# Altium project NB992F.PrjPcb
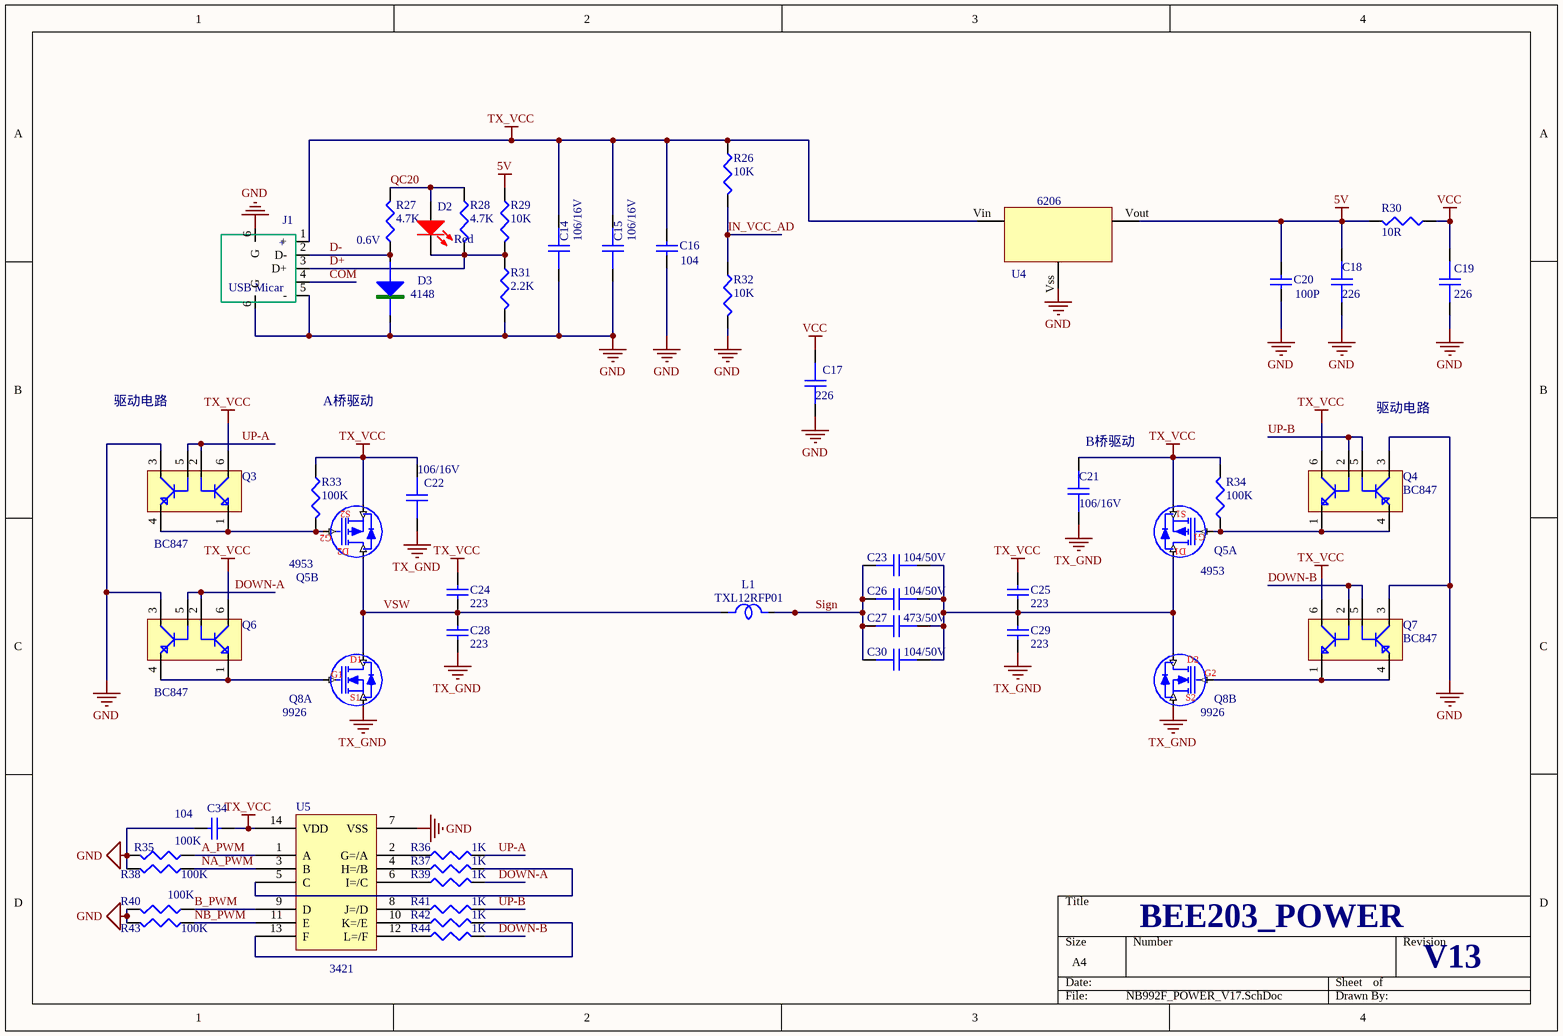
[diagram p0: NB992F_POWER_V17.SchDoc]
2 sheets, 90 parts. Net scope: global (net labels, ports and power ports of the same name join across sheets).
Board file: XL992FXT10W.PcbDoc
Sheets:
  NB992F_POWER_V17.SchDoc
  NB992F_XL_N76E003_MAIN.SchDoc

## Sheet NB992F_POWER_V17.SchDoc
size A4

### Parts
C14  106/16V  [C0805]
C15  106/16V  [C0805]
C16  104  [C0402]
C17  226  [C0603]
C18  226  [C0805]
C19  226  [C0805]
C20  100P  [C0402]
C21  106/16V  [C0805]
C22  106/16V  [C0805]
C23  104/50V  [C1206]
C24  223  [C0603]
C25  223  [C0603]
C26  104/50V  [C1206]
C27  473/50V  [C1206]
C28  223  [C0603]
C29  223  [C0603]
C30  104/50V  [C1206]
C34  104  [C0402]
D2  Red  [LED0603]
D3  4148  [SOD323]
J1  USB Micar  [USB MRO]
L1  TXL12RFP01  [SPIN2_5mm]
Q3  BC847  [SOT-363]
Q4  BC847  [SOT-363]
Q5  4953  [SOP8D]  (parts A,B of 2)
Q6  BC847  [SOT-363]
Q7  BC847  [SOT-363]
Q8  9926  [SOP8D]  (parts A,B of 2)
R26  10K  [R0402]
R27  4.7K  [R0402]
R28  4.7K  [R0402]
R29  10K  [R0402]
R30  10R  [R0402]
R31  2.2K  [R0402]
R32  10K  [R0402]
R33  100K  [R0402]
R34  100K  [R0402]
R35  100K  [R0402]
R36  1K  [R0402]
R37  1K  [R0402]
R38  100K  [R0402]
R39  1K  [R0402]
R40  100K  [R0402]
R41  1K  [R0402]
R42  1K  [R0402]
R43  100K  [R0402]
R44  1K  [R0402]
U4  6206  [SOT-89-5V]
U5  3421  [SOP14]

### Nets
5V: C18.1 C20.1 R29.2 R30.2 U4.Vout
GND: C14.2 C15.2 C16.2 C17.1 C18.2 C19.1 C20.2 C34.1 D3.2 J1.5(-) J1.6(G) Q3.3 Q4.3 Q6.3 Q7.3 R31.1 R32.1 R35.2 R38.2 R40.2 R43.2 U4.Vss U5.7(VSS)
TX_GND: C21.2 C22.2 C28.1 C29.1 Q8.E1(S1) Q8.E2(S2)
TX_VCC: C14.1 C15.1 C16.1 C21.1 C22.1 C24.2 C25.2 C34.2 J1.1(+) Q3.6 Q4.6 Q5.E1(S1) Q5.E2(S2) Q6.6 Q7.6 R26.2 R33.1 R34.2 U4.Vin U5.14(VDD)
VCC: C17.2 C19.2 R30.1
A_PWM: R35.1 U5.1(A)
B_PWM: R40.1 U5.9(D)
COM: J1.4
D+: D2.2(K) J1.3(D+) R28.1 R29.1 R31.2
D-: D3.1 J1.2(D-) R27.2
DOWN-A: Q6.2 Q6.5 R39.2
DOWN-B: Q7.2 Q7.5 R44.2
IN_VCC_AD: R26.1 R32.2
NA_PWM: R38.1 U5.3(B)
NB_PWM: R43.1 U5.11(E)
QC20: D2.1(A) R27.1 R28.2
Sign: C23.1 C26.1 C27.1 C30.1 L1.2
UP-A: Q3.2 Q3.5 R36.2
UP-B: Q4.2 Q4.5 R41.2
VSW: C24.1 C28.2 L1.1 Q5.C2(D2) Q8.C1(D1)
NetC23_2: C23.2 C25.1 C26.2 C27.2 C29.2 C30.2 Q5.C1(D1) Q8.C2(D2)
NetQ3_1: Q3.1 Q3.4 Q5.B2(G2) R33.2
NetQ4_1: Q4.1 Q4.4 Q5.B1(G1) R34.1
NetQ6_1: Q6.1 Q6.4 Q8.B1(G1)
NetQ7_1: Q7.1 Q7.4 Q8.B2(G2)
NetR36_1: R36.1 U5.2(G=/A)
NetR37_1: R37.1 U5.4(H=/B)
NetR37_2: R37.2 U5.5(C)
NetR39_1: R39.1 U5.6(I=/C)
NetR41_1: R41.1 U5.8(J=/D)
NetR42_1: R42.1 U5.10(K=/E)
NetR42_2: R42.2 U5.13(F)
NetR44_1: R44.1 U5.12(L=/F)

### Notes on the sheet
- 0.6V
- 驱动电路
- A桥驱动
- (near C21) B桥驱动
- BEE203_POWER
- V13

### Library data of the parts
C14 C15 C17-C19 C21-C23 C26 C27 C30 = CH
C16 C34 = Cap: Capacitor; Published: 8-Jun-2000; LatestRevisionDate: 17-Jul-2002; LatestRevisionNote: Re-released for DXP Platform.; Publisher: Altium Limited; Value: 104
C20 C24 C25 C28 C29 = Cap: Capacitor; Value: 104; Published: 8-Jun-2000; LatestRevisionDate: 17-Jul-2002; LatestRevisionNote: Re-released for DXP Platform.; Publisher: Altium Limited
D2 = LED02
D3 = D0: 1N4001
J1 = USB
L1 = L: 1uH
Q3 Q4 Q6 Q7 = D_PNP
Q5 = MOSFETP2
Q8 = MOSFETN2
R26-R35 R38 R40 R43 = R: 1K
R36 R37 R39 R41 R42 R44 = R
U4 = VOLTREG
U5 = CD4069

## Sheet NB992F_XL_N76E003_MAIN.SchDoc
size A4
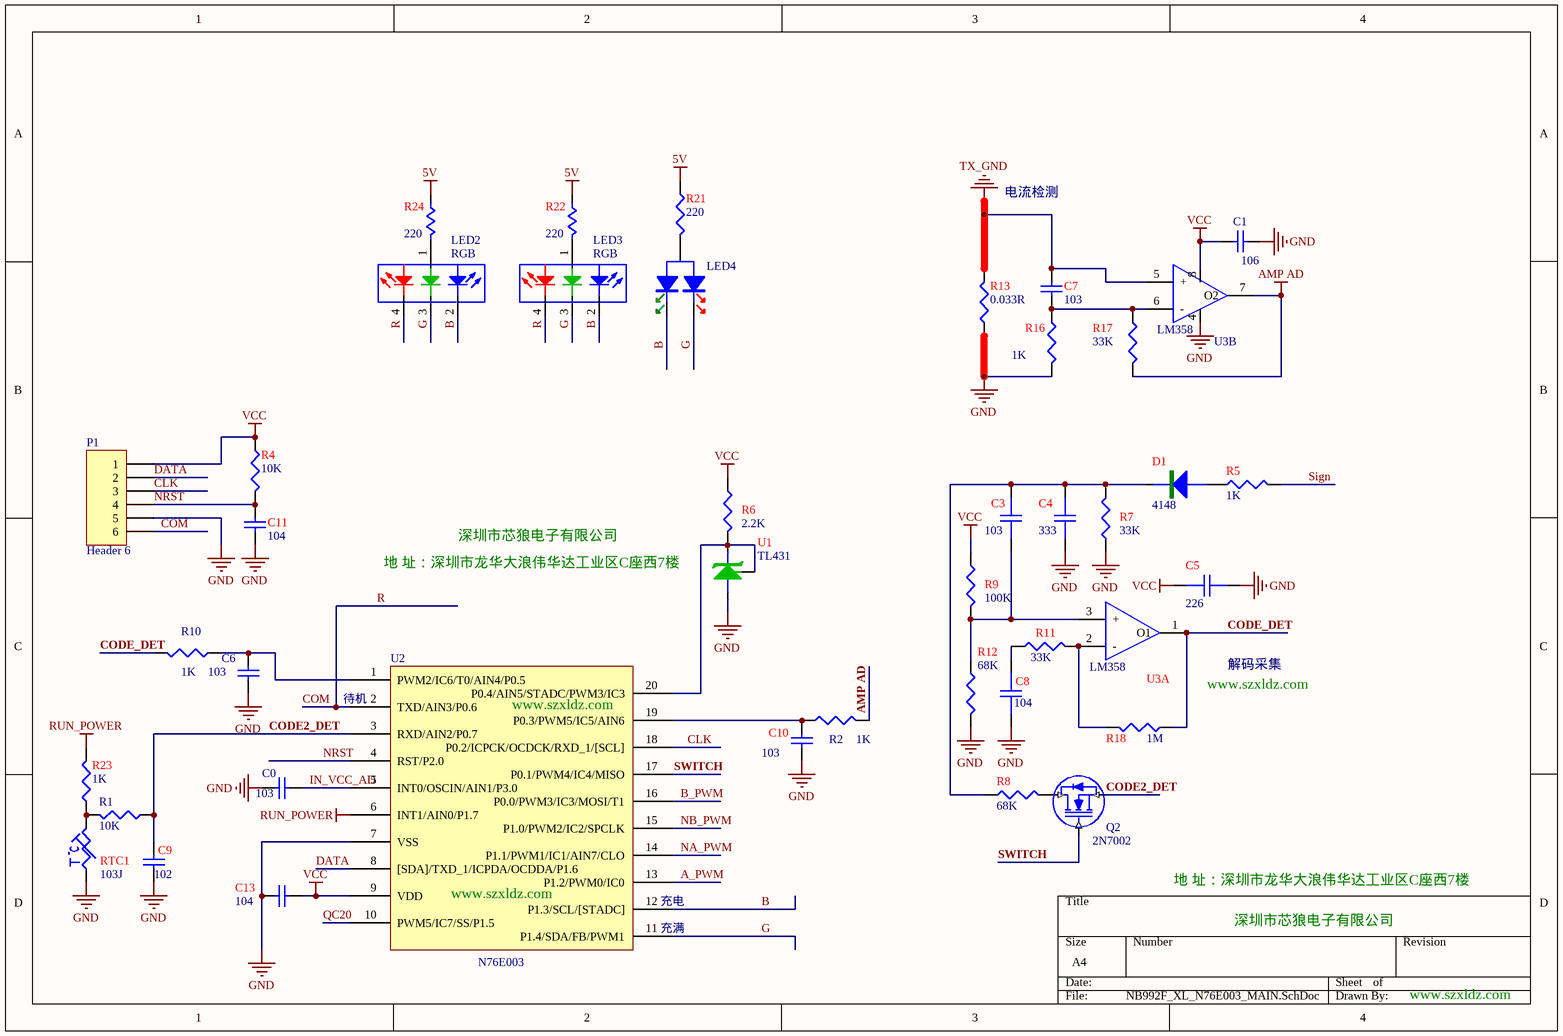
[diagram p1: NB992F_XL_N76E003_MAIN.SchDoc]

### Parts
C0  103  [C0402]
C1  106  [C0603]
C3  103  [C0402]
C4  333  [C0402]
C5  226  [C0805]
C6  103  [C0402]
C7  103  [C0402]
C8  104  [C0402]
C9  102  [C0402]
C10  103  [C0402]
C11  104  [C0402]
C13  104  [C0402]
D1  4148  [sod323]
LED2  RGB  [LED-RGB02]
LED3  RGB  [LED-RGB02]
LED4  (no value)  [LED2]
P1  Header 6  [SPIN6]
Q2  2N7002  [SOT-23B]
R1  10K  [R0402]
R2  1K  [R0402]
R4  10K  [R0402]
R5  1K  [R0402]
R6  2.2K  [R0402]
R7  33K  [R0402]
R8  68K  [R0402]
R9  100K  [R0402]
R10  1K  [R0402]
R11  33K  [R0402]
R12  68K  [R0402]
R13  0.033R  [R0805]
R16  1K  [R0402]
R17  33K  [R0402]
R18  1M  [R0402]
R21  220  [R0402]
R22  220  [R0402]
R23  1K  [R0402]
R24  220  [R0402]
RTC1  103J  [R0402]
U1  TL431  [SOT-23A]
U2  N76E003  [TSSOP20]
U3  LM358  [SOP8]  (parts A,B of 2)

### Nets
5V: R21.1 R22.1 R24.1
AMP AD: R2.2 R17.2 U3.7(O2)
GND: C0.1 C1.1 C4.1 C5.1 C6.1 C8.1 C9.1 C10.2 C11.2 C13.1 P1.5 R7.1 R12.2 R13.1 R16.2 RTC1.1 U1.1 U2.7(VSS) U3.4
RUN_POWER: R23.2 U2.6(INT1/AIN0/P1.7)
TX_GND: C7.1 R13.2 U3.5(+)
VCC: C1.2 C5.2 C13.2 P1.1 R4.1 R6.1 R9.1 U2.9(VDD) U3.8
A_PWM: U2.13(P1.2/PWM0/IC0)
B: LED2.2(A) LED3.2(A) LED4.3 U2.12(P1.3/SCL/[STADC])
B_PWM: U2.16(P0.0/PWM3/IC3/MOSI/T1)
CLK: P1.3 U2.18(P0.2/ICPCK/OCDCK/RXD_1/[SCL])
CODE2_DET: C9.2 Q2.E(S) R1.1 U2.3(RXD/AIN2/P0.7)
CODE_DET: R10.2 R18.1 U3.1(O1)
COM: LED2.4 LED3.4 P1.6 U2.2(TXD/AIN3/P0.6)  [also labelled R]
DATA: P1.2 U2.8([SDA]/TXD_1/ICPDA/OCDDA/P1.6)
G: LED2.3 LED3.3 LED4.1 U2.11(P1.4/SDA/FB/PWM1)
IN_VCC_AD: C0.2 U2.5(INT0/OSCIN/AIN1/P3.0)
NA_PWM: U2.14(P1.1/PWM1/IC1/AIN7/CLO)
NB_PWM: U2.15(P1.0/PWM2/IC2/SPCLK)
NRST: C11.1 P1.4 R4.2 U2.4(RST/P2.0)
QC20: U2.10(PWM5/IC7/SS/P1.5)
Sign: R5.2
SWITCH: Q2.B(G) U2.17(P0.1/PWM4/IC4/MISO)
NetC3_1: C3.1 C4.2 D1.2 R7.2 R8.1
NetC3_2: C3.2 R9.2 R12.1 U3.3(+)
NetC6_2: C6.2 R10.1 U2.1(PWM2/IC6/T0/AIN4/P0.5)
NetC7_2: C7.2 R16.1 R17.1 U3.6(-)
NetC8_2: C8.2 R11.1
NetC10_1: C10.1 R2.1 U2.19(P0.3/PWM5/IC5/AIN6)
NetD1_1: D1.1 R5.1
NetLED2_1: LED2.1(A) R24.2
NetLED3_1: LED3.1(A) R22.2
NetLED4_2: LED4.2 R21.2
NetQ2_C: Q2.C(D) R8.2
NetR1_2: R1.2 R23.1 RTC1.2
NetR6_2: R6.2 U1.2 U1.3 U2.20(P0.4/AIN5/STADC/PWM3/IC3)
NetR11_2: R11.2 R18.2 U3.2(-)

### Notes on the sheet
- 电流检测
- 地 址：深圳市龙华大浪伟华达工业区C座西7楼
- 深圳市芯狼电子有限公司
- (near U2) 待机
- (near U2) www.szxldz.com
- www.szxldz.com
- 解码采集
- (near U2) 充电
- (near U2) 充满

### Library data of the parts
C0 C6 C9-C11 C13 = Cap: Capacitor; Published: 8-Jun-2000; LatestRevisionDate: 17-Jul-2002; LatestRevisionNote: Re-released for DXP Platform.; Publisher: Altium Limited
  C6 C10: Value: 103
  C9: Value: 102
  C11: Value: 104
C1 C7 = Cap: Capacitor; Value: 104; Published: 8-Jun-2000; LatestRevisionDate: 17-Jul-2002; LatestRevisionNote: Re-released for DXP Platform.; Publisher: Altium Limited
C3-C5 C8 = CH
D1 = D0: 1N4001
LED2 LED3 = LED05
LED4 = LED2A
P1 = Header 6: Header, 6-Pin; LatestRevisionDate: 17-Jul-2002; LatestRevisionNote: Re-released for DXP Platform.; Publisher: Altium Limited
Q2 = MOSFETN
R1 R6-R9 R11-R13 R17 R18 R21 = R: 1K
R2 R4 R5 R10 R16 R23 = R
R22 R24 = Res01
RTC1 = RTC
U1 = IC TL431: IC
U2 = 103F
U3 = 4558

## Nets that join several sheets
5V: NB992F_POWER_V17 (5 pins), NB992F_XL_N76E003_MAIN (R21.1 R22.1 R24.1)
GND: NB992F_POWER_V17 (23 pins), NB992F_XL_N76E003_MAIN (19 pins)
TX_GND: NB992F_POWER_V17 (6 pins), NB992F_XL_N76E003_MAIN (C7.1 R13.2 U3.5)
VCC: NB992F_POWER_V17 (C17.2 C19.2 R30.1), NB992F_XL_N76E003_MAIN (9 pins)
A_PWM: NB992F_POWER_V17 (R35.1 U5.1), NB992F_XL_N76E003_MAIN (U2.13)
B_PWM: NB992F_POWER_V17 (R40.1 U5.9), NB992F_XL_N76E003_MAIN (U2.16)
COM: NB992F_POWER_V17 (J1.4), NB992F_XL_N76E003_MAIN (LED2.4 LED3.4 P1.6 U2.2)
IN_VCC_AD: NB992F_POWER_V17 (R26.1 R32.2), NB992F_XL_N76E003_MAIN (C0.2 U2.5)
NA_PWM: NB992F_POWER_V17 (R38.1 U5.3), NB992F_XL_N76E003_MAIN (U2.14)
NB_PWM: NB992F_POWER_V17 (R43.1 U5.11), NB992F_XL_N76E003_MAIN (U2.15)
QC20: NB992F_POWER_V17 (D2.1 R27.1 R28.2), NB992F_XL_N76E003_MAIN (U2.10)
Sign: NB992F_POWER_V17 (5 pins), NB992F_XL_N76E003_MAIN (R5.2)